# Altium schematic sheet Fonte.SchDoc
size B
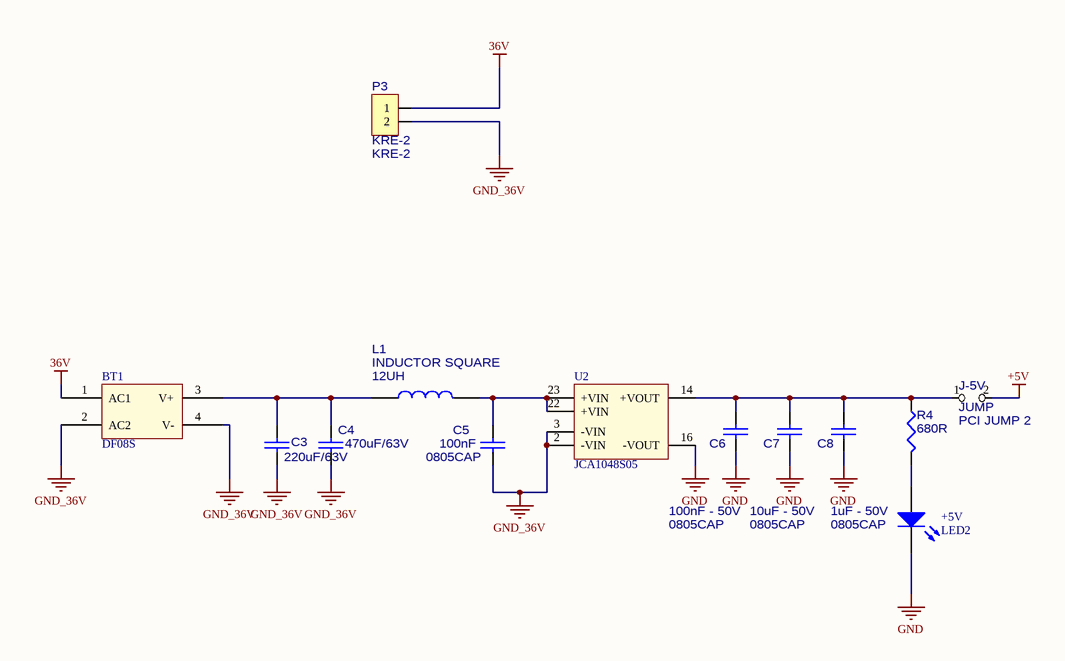
[diagram p0: Fonte.SchDoc]

## Parts
+5V  LED2  [3.2X1.6X1.1]
BT1  DF08S  [DF-S]
C3  220uF/63V  [CAP_ELET_SMD_10x13.5]
C4  470uF/63V  [CAP_ELET_SMD_10x13.5]
C5  Footprint: 0805CAP  [CAP0805]  (hidden comment: 100nF)
C6  Footprint: 0805CAP  [CAP0805]  (hidden comment: 100nF - 50V)
C7  Footprint: 0805CAP  [CAP0805]  (hidden comment: 10uF - 50V)
C8  Footprint: 0805CAP  [CAP0805]  (hidden comment: 1uF - 50V)
J-5V  Footprint: PCI JUMP 2  [JUMP2_0805]  (hidden comment: JUMP)
L1  value 12UH  Footprint: INDUCTOR SQUARE  [IND 61X61]  (hidden comment: 470UH)
P3  KRE-2  [KRE-2]
R4  680R  [0805RES]
U2  JCA1048S05  [SCW05]

## Nets
36V: BT1.1(AC1) P3.1
+5V: J-5V.2
GND: +5V.2(K) C6.2 C7.2 C8.2 U2.16(-VOUT)
GND_36V: BT1.2(AC2) BT1.4(V-) C3.1 C4.1 C5.2 P3.2 U2.2(-VIN) U2.3(-VIN)
Net+5V_1: +5V.1(A) R4.2
NetBT1_3: BT1.3(V+) C3.2 C4.2 L1.1
NetC5_1: C5.1 L1.2 U2.22(+VIN) U2.23(+VIN)
NetC6_1: C6.1 C7.1 C8.1 J-5V.1 R4.1 U2.14(+VOUT)

Not connected (* = marked no-connect by the designer): U2 9(NC) 11(NC)

## Library data of the parts
+5V = LED2: Typical RED, GREEN, YELLOW, AMBER GaAs LED; Published: 8-Jun-2000; LatestRevisionDate: 17-Jul-2002; LatestRevisionNote: Re-released for DXP Platform.; PackageVersion: Feb-2002; PackageReference: 3.2X1.6X1.1; Publisher: Altium Limited; PackageDescription: SM LED; 2 Flat Leads
C3-C8 = CAP
  C3: Value: 220uF/63V; Digikey: UWT1V221MNL1GS
  C4: Value: 470uF/63V; Footprint: 0805CAP; Digikey: UCL1V471MNL1GS
  C5: Value: 100nF; Digikey: 1276-1007-1-ND
  C6: Value: 100nF - 50V; Digikey: 1276-1007-1-ND
  C7: Value: 10uF - 50V; Digikey: 1276-1007-1-ND
  C8: Value: 1uF - 50V; Digikey: 1276-1007-1-ND
J-5V = JUMP: Class: DDR2_2_4; ClassName: FONTE_3V3; Value: JUMP
L1 = IND: Inductor; Digikey: SRR1280-471KLCT-ND
P3 = CON2_2_2: ClassName: Fonte2; ClassName: RELAY; Value: KRE-2
R4 = Res0805: 2.2 Ohm 5% 1/16W 0603 RES SMT; Value: 680R
U2 = SCW05